# EAGLE schematic midi_to_cv (EAGLE 7.1.0)
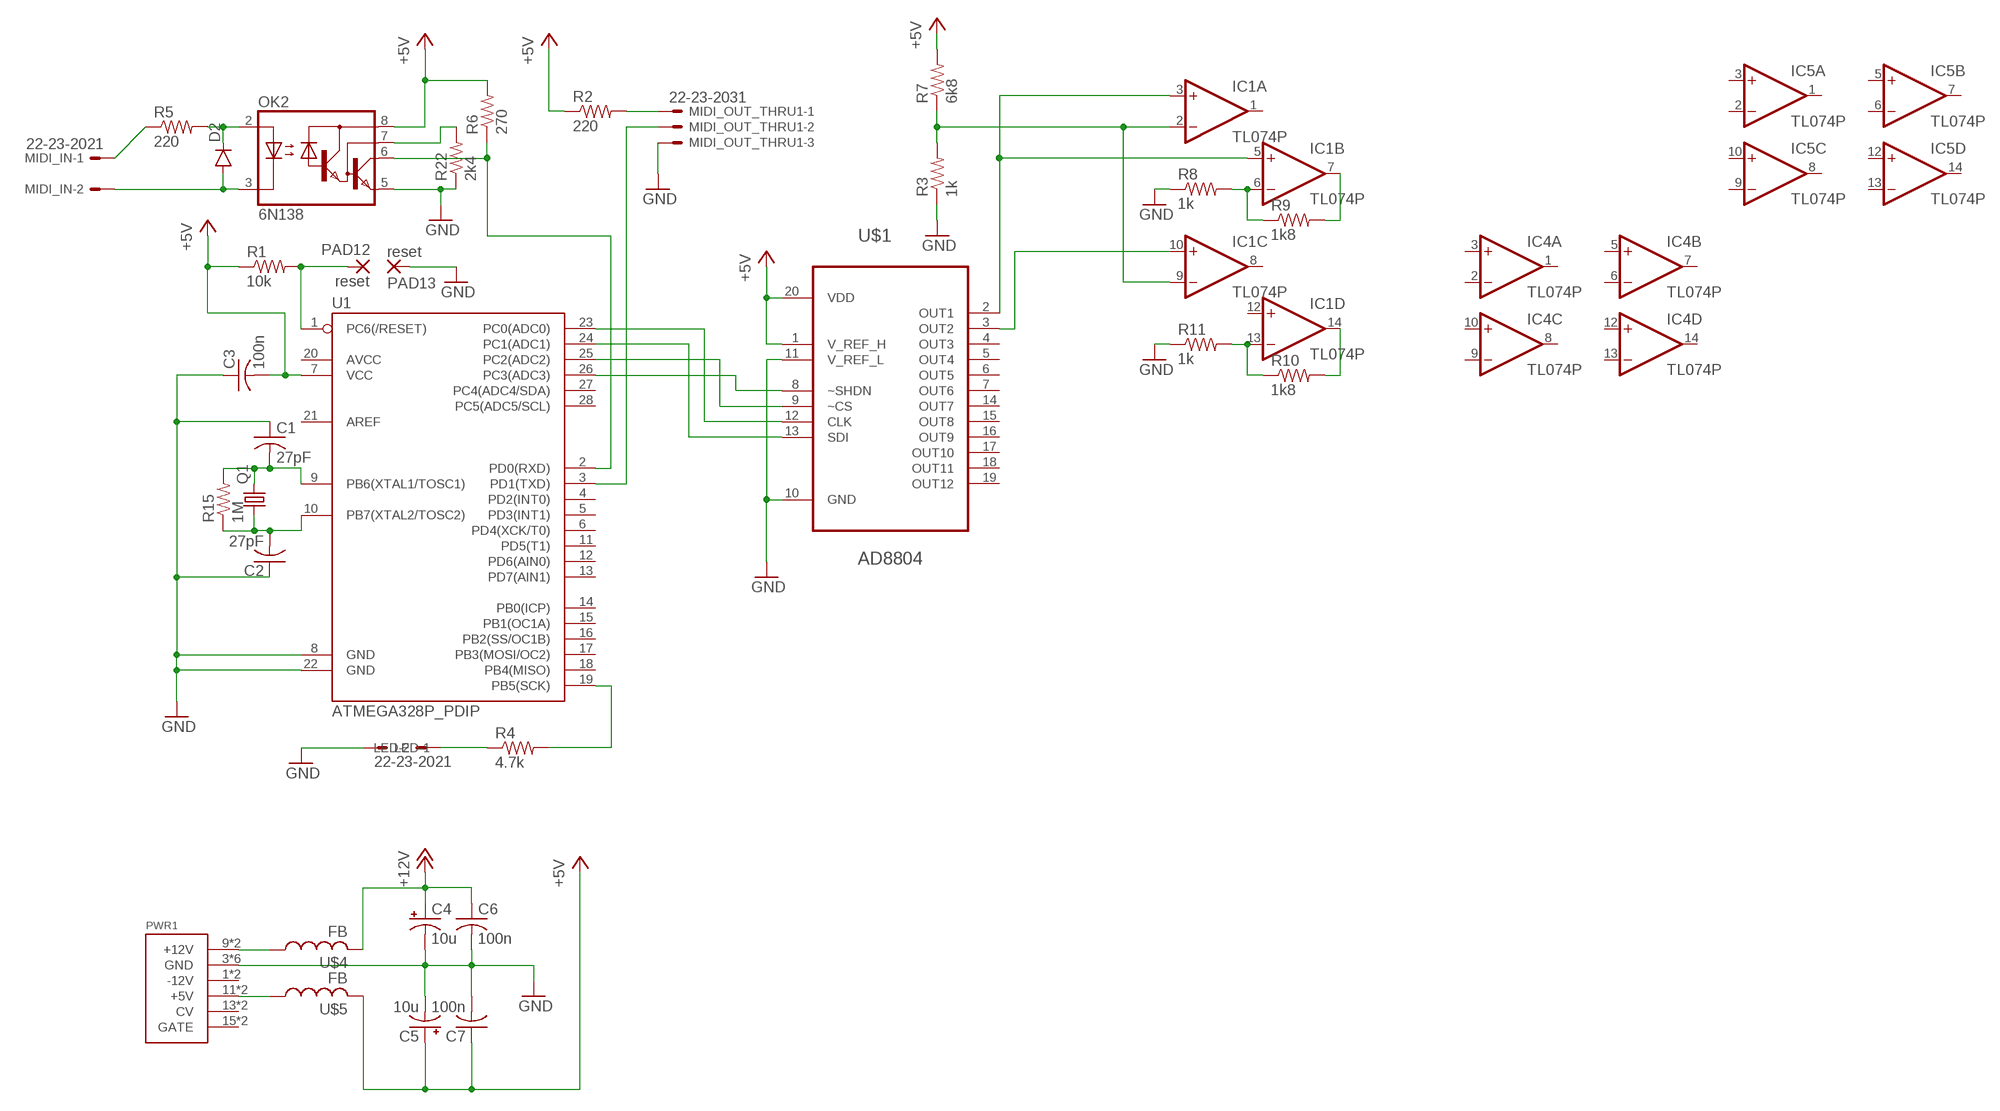
[diagram p0: schematic, sheet 1]

## Parts
C1  27pF  C-US025-040X050  [C025-040X050]
C2  27pF  C-US025-040X050  [C025-040X050]
C3  100n  C-US025-040X050  [C025-040X050]
C4  10u  CPOL-USB45181A  [B45181A]
C5  10u  CPOL-USB45181A  [B45181A]
C6  100n  C-US050-024X044  [C050-024X044]
C7  100n  C-US050-024X044  [C050-024X044]
D2  DIODE1N4148  [DIODE-1N4148]
IC1  TL074P  [DIL14]
IC4  TL074P  [DIL14]
IC5  TL074P  [DIL14]
LED  22-23-2021  [22-23-2021]
MIDI_IN  22-23-2021  [22-23-2021]
MIDI_OUT_THRU1  22-23-2031  [22-23-2031]
OK2  6N138  [DIL08]
PAD12  reset  2,54/0,9  [2,54/0,9]
PAD13  reset  2,54/0,9  [2,54/0,9]
PWR1  POWER  [POWER_16]
Q1  CRYSTALHC49U-V  [HC49U-V]
R1  10k  R-US_0207/10  [0207/10]
R2  220  R-US_0207/10  [0207/10]
R3  1k  R-US_0207/10  [0207/10]
R4  4.7k  R-US_0207/10  [0207/10]
R5  220  R-US_0207/10  [0207/10]
R6  270  R-US_0207/10  [0207/10]
R7  6k8  R-US_0207/10  [0207/10]
R8  1k  R-US_0207/10  [0207/10]
R9  1k8  R-US_0207/10  [0207/10]
R10  1k8  R-US_0207/10  [0207/10]
R11  1k  R-US_0207/10  [0207/10]
R15  1M  R-US_0207/10  [0207/10]
R22  2k4  R-US_0207/10  [0207/10]
U1  ATMEGA328P_PDIP  [DIL28-3]
U$1  AD8804  [DIL20]
U$4  FB  [FB]
U$5  FB  [FB]

## Nets
+5V: C3.2 C5.+ C7.1 OK2.8(VCC) R1.1 R2.1 R6.2 R7.2 U1.7(VCC) U$1.1(V_REF_H) U$1.20(VDD) U$5.P$2
+12V: C4.+ C6.1 U$4.P$2
GND: C1.1 C2.1 C3.1 C4.- C5.- C6.2 C7.2 LED.1 MIDI_OUT_THRU1.3 OK2.5(GND) PAD13.1(P) PWR1.3(GND) PWR1.4(GND) PWR1.5(GND) PWR1.6(GND) PWR1.7(GND) PWR1.8(GND) R3.1 R8.1 R11.1 R22.1 U1.8(GND) U1.22(GND) U$1.10(GND) U$1.11(V_REF_L)
N$1: PAD12.1(P) R1.2 U1.1(PC6(/RESET))
N$2: PWR1.9(+12V) PWR1.10(+12V) U$4.P$1
N$3: U1.26(PC3(ADC3)) U$1.8(~SHDN)
N$4: C1.2 Q1.2 R15.2 U1.9(PB6(XTAL1/TOSC1))
N$5: C2.2 Q1.1 R15.1 U1.10(PB7(XTAL2/TOSC2))
N$6: U1.25(PC2(ADC2)) U$1.9(~CS)
N$7: U1.23(PC0(ADC0)) U$1.12(CLK)
N$8: U1.24(PC1(ADC1)) U$1.13(SDI)
N$9: MIDI_OUT_THRU1.1 R2.2
N$10: R4.2 U1.19(PB5(SCK))
N$11: LED.2 R4.1
N$12: MIDI_OUT_THRU1.2 U1.3(PD1(TXD))
N$13: IC1.2(A:-IN) IC1.9(C:-IN) R3.2 R7.1
N$14: IC1.3(A:+IN) IC1.5(B:+IN) U$1.2(OUT1)
N$15: IC1.6(B:-IN) R8.2 R9.1
N$16: IC1.7(B:OUT) R9.2
N$17: D2.A MIDI_IN.2 OK2.3(C)
N$18: D2.C OK2.2(A) R5.2
N$19: MIDI_IN.1 R5.1
N$20: OK2.6(VO) R6.1 U1.2(PD0(RXD))
N$21: IC1.13(D:-IN) R10.1 R11.2
N$22: IC1.10(C:+IN) U$1.3(OUT2)
N$23: IC1.14(D:OUT) R10.2
N$60: OK2.7(VB) R22.2
N$62: PWR1.11(+5V) PWR1.12(+5V) U$5.P$1
Unconnected: IC1.1(A:OUT) IC1.8(C:OUT) IC1.12(D:+IN) IC4.1(A:OUT) IC4.2(A:-IN) IC4.3(A:+IN) IC4.5(B:+IN) IC4.6(B:-IN) IC4.7(B:OUT) IC4.8(C:OUT) IC4.9(C:-IN) IC4.10(C:+IN) IC4.12(D:+IN) IC4.13(D:-IN) IC4.14(D:OUT) IC5.1(A:OUT) IC5.2(A:-IN) IC5.3(A:+IN) IC5.5(B:+IN) IC5.6(B:-IN) IC5.7(B:OUT) IC5.8(C:OUT) IC5.9(C:-IN) IC5.10(C:+IN) IC5.12(D:+IN) IC5.13(D:-IN) IC5.14(D:OUT) PWR1.1(-12V) PWR1.2(-12V) PWR1.13(CV) PWR1.14(CV) PWR1.15(GATE) PWR1.16(GATE) U1.4(PD2(INT0)) U1.5(PD3(INT1)) U1.6(PD4(XCK/T0)) U1.11(PD5(T1)) U1.12(PD6(AIN0)) U1.13(PD7(AIN1)) U1.14(PB0(ICP)) U1.15(PB1(OC1A)) U1.16(PB2(SS/OC1B)) U1.17(PB3(MOSI/OC2)) U1.18(PB4(MISO)) U1.20(AVCC) U1.21(AREF) U1.27(PC4(ADC4/SDA)) U1.28(PC5(ADC5/SCL)) U$1.4(OUT3) U$1.5(OUT4) U$1.6(OUT5) U$1.7(OUT6) U$1.14(OUT7) U$1.15(OUT8) U$1.16(OUT9) U$1.17(OUT10) U$1.18(OUT11) U$1.19(OUT12)

## Power pins joined to a net without a drawn wire
V+: IC1.4(P:V+) IC4.4(P:V+) IC5.4(P:V+)
V-: IC1.11(P:V-) IC4.11(P:V-) IC5.11(P:V-)

## Library data of the parts
C1-C3 C6 C7 = rcl:C-US: CAPACITOR, American symbol
C4 C5 = rcl:CPOL-US: POLARIZED CAPACITOR, American symbol
D2 = SparkFun-DiscreteSemi:DIODE: Diode These are standard reverse protection diodes and small signal diodes. SMA package can handle up to about 1A. SOD-323 can handle about 200mA. What the SOD-323 package when ordering, there are some mfgs out there that are 5-pin packages.
IC1 IC4 IC5 = linear:TL074: OP AMP
LED MIDI_IN = con-molex:22-23-2021: .100" (2.54mm) Center Header - 2 Pin; MF: MOLEX; MPN: 22-23-2021; OC_FARNELL: 1462926; OC_NEWARK: 25C3832
MIDI_OUT_THRU1 = con-molex:22-23-2031: .100" (2.54mm) Center Header - 3 Pin; MF: MOLEX; MPN: 22-23-2031; OC_FARNELL: 1462950; OC_NEWARK: 30C0862
OK2 = optocoupler:6N138: MOTOROLA OPTO COUPLER; MF: VISHAY/TELEFUNKEN; MPN: 6N138; OC_FARNELL: 9860150; OC_NEWARK: 35K5294
PAD12 PAD13 = wirepad:2,54/0,9: THROUGH-HOLE PAD
PWR1 = eurorack:POWER
Q1 = crystal:CRYSTAL: CRYSTAL; OC_FARNELL: 1666969; OC_NEWARK: unknown
R1-R11 R15 R22 = rcl:R-US_: RESISTOR, American symbol
U1 = SparkFun-DigitalIC:ATMEGA328P_PDIP: uC used in the Arduino 32kb flash, 1k EEPROM, 2k SRAM This is the through-hole version of this chip.
U$1 = ic-package:AD8804
U$4 U$5 = adafruit:FB: Ferrite bead Digikey #P9821BK-ND